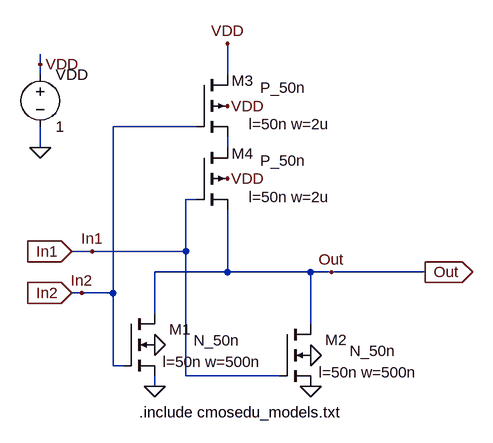
[diagram p0: schematic NOR2.asc]
NOR2.asc, the LTspice schematic file:
Version 4
SHEET 1 1220 680
WIRE 320 -512 320 -528
WIRE 320 -496 320 -512
WIRE 608 -496 608 -544
WIRE 560 -416 432 -416
WIRE 320 -384 320 -416
WIRE 608 -384 608 -400
WIRE 560 -304 544 -304
WIRE 400 -224 368 -224
WIRE 544 -224 544 -304
WIRE 544 -224 400 -224
WIRE 608 -192 608 -288
WIRE 608 -192 496 -192
WIRE 736 -192 608 -192
WIRE 768 -192 736 -192
WIRE 912 -192 768 -192
WIRE 384 -160 368 -160
WIRE 432 -160 432 -416
WIRE 432 -160 384 -160
WIRE 496 -128 496 -192
WIRE 736 -112 736 -192
WIRE 432 -48 432 -160
WIRE 448 -48 432 -48
WIRE 544 -32 544 -224
WIRE 688 -32 544 -32
WIRE 496 -16 496 -32
FLAG 736 -64 0
FLAG 320 -384 0
FLAG 320 -512 VDD
FLAG 608 -448 VDD
FLAG 496 -16 0
FLAG 608 -544 VDD
FLAG 608 -336 VDD
FLAG 496 -80 0
FLAG 400 -224 In1
FLAG 384 -160 In2
FLAG 736 -16 0
FLAG 912 -192 Out
IOPIN 912 -192 Out
FLAG 368 -224 In1
IOPIN 368 -224 In
FLAG 368 -160 In2
IOPIN 368 -160 In
FLAG 768 -192 Out
SYMBOL voltage 320 -512 R0
WINDOW 123 0 0 Left 2
WINDOW 39 0 0 Left 2
SYMATTR InstName VDD
SYMATTR Value 1
SYMBOL pmos4 560 -496 R0
WINDOW 0 88 9 Right 2
WINDOW 3 168 20 Right 2
WINDOW 123 206 76 Right 2
SYMATTR InstName M3
SYMATTR Value P_50n
SYMATTR Value2 l=50n w=2u
SYMBOL nmos4 448 -128 R0
WINDOW 0 104 24 Right 2
WINDOW 3 179 41 Right 2
WINDOW 123 213 74 Right 2
SYMATTR InstName M1
SYMATTR Value N_50n
SYMATTR Value2 l=50n w=500n
SYMBOL nmos4 688 -112 R0
WINDOW 0 104 24 Right 2
WINDOW 3 179 41 Right 2
WINDOW 123 213 74 Right 2
SYMATTR InstName M2
SYMATTR Value N_50n
SYMATTR Value2 l=50n w=500n
SYMBOL pmos4 560 -384 R0
WINDOW 0 88 9 Right 2
WINDOW 3 168 20 Right 2
WINDOW 123 206 76 Right 2
SYMATTR InstName M4
SYMATTR Value P_50n
SYMATTR Value2 l=50n w=2u
TEXT 472 24 Left 2 !.include cmosedu_models.txt

The netlist it stands for:
* NOR2.asc
VDD VDD 0 1
M3 VDD In2 N001 VDD P_50n l=50n w=2u
M1 Out In2 0 0 N_50n l=50n w=500n
M2 Out In1 0 0 N_50n l=50n w=500n
M4 N001 In1 Out VDD P_50n l=50n w=2u
.model NMOS NMOS
.model PMOS PMOS
.lib standard.mos
.include cmosedu_models.txt
.backanno
.end